# EAGLE design TargetADC (EAGLE 7.3.0)
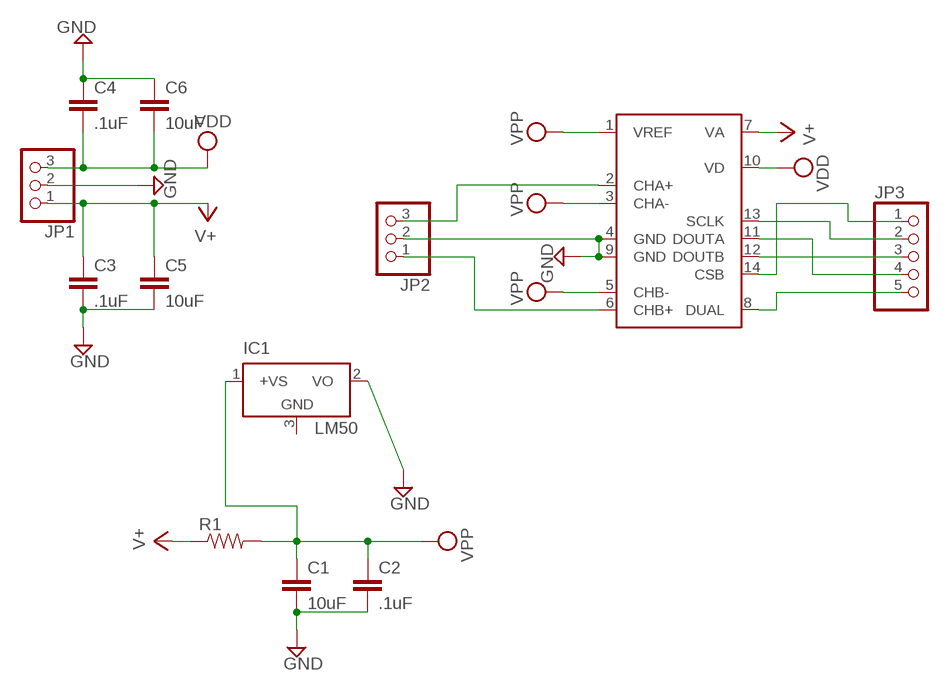
[diagram p0: schematic, sheet 1]

## Parts
C1  10uF  CAP0805  [0805]
C2  .1uF  CAP0805  [0805]
C3  .1uF  CAP0805  [0805]
C4  .1uF  CAP0805  [0805]
C5  10uF  CAP0805  [0805]
C6  10uF  CAP0805  [0805]
IC1  LM50  [SOT23]
JP1  PINHD-1X3  [1X03]
JP2  PINHD-1X3  [1X03]
JP3  PINHD-1X5  [1X05]
R1  RESISTOR0805-RES  [0805]
U1  ADC122S706  [TSSOP14]

## Nets
GND: C1.2 C2.2 C3.2 C4.1 C5.2 C6.1 IC1.2(VO) JP1.2 JP2.2 U1.4(GND) U1.9(GND)
N$1: JP3.4 U1.11(DOUTA)
N$2: JP2.3 U1.2(CHA+)
N$3: JP2.1 U1.6(CHB+)
N$4: JP3.3 U1.12(DOUTB)
N$5: JP3.2 U1.13(SCLK)
N$6: JP3.1 U1.14(CSB)
N$7: JP3.5 U1.8(DUAL)
V+: C3.1 C5.1 JP1.1 R1.1 U1.7(VA)
VDD: C4.2 C6.2 JP1.3 U1.10(VD)
VPP: C1.1 C2.1 IC1.1(+VS) R1.2 U1.1(VREF) U1.3(CHA-) U1.5(CHB-)

## Power pins joined to a net without a drawn wire
GND: IC1.3(GND)

## Library data of the parts
C1-C6 = SparkFun-Capacitors:CAP: Capacitor Standard 0603 ceramic capacitor, and 0.1" leaded capacitor.
IC1 = linear:LM50: SOT-23 Single-Supply Centigrade Temperature Sensor Vout = (10mV/°C x Temp °C) +5mmmV Source: http://cache.national.com/ds/LM/LM50.pdf
JP1 JP2 = pinhead:PINHD-1X3: PIN HEADER
JP3 = pinhead:PINHD-1X5: PIN HEADER
R1 = SparkFun-Resistors:RESISTOR: Resistor Basic schematic elements and footprints for 0603, 1206, and PTH resistors.
U1 = ADC122S706:ADC122S706

## Board
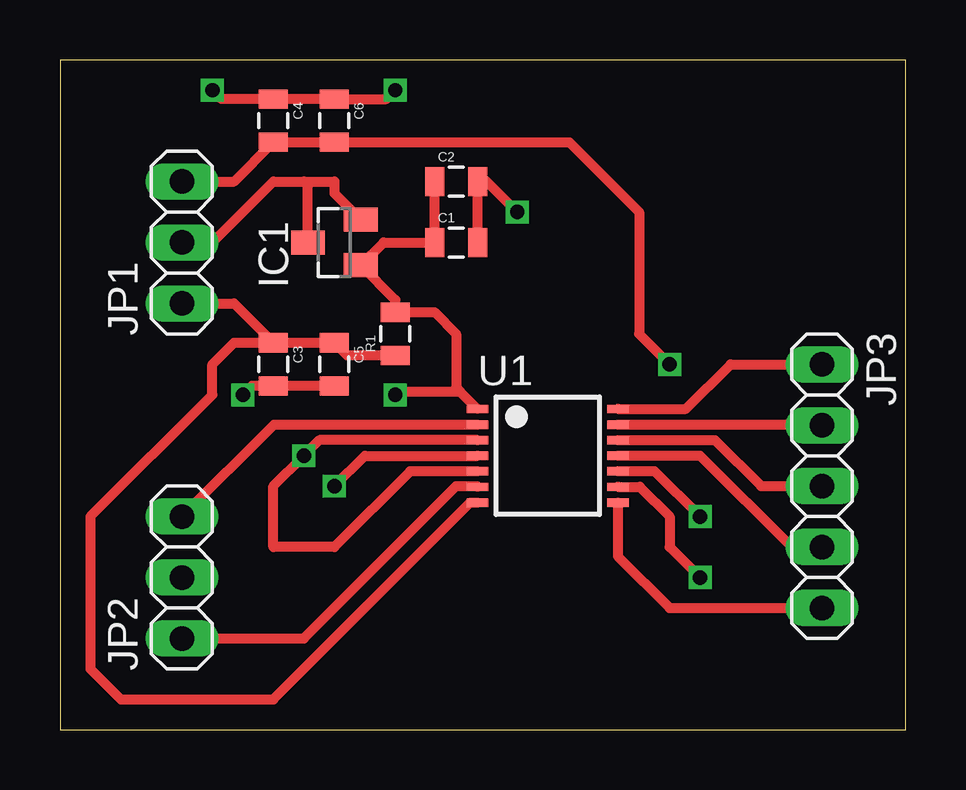
[diagram p1: board, top side]
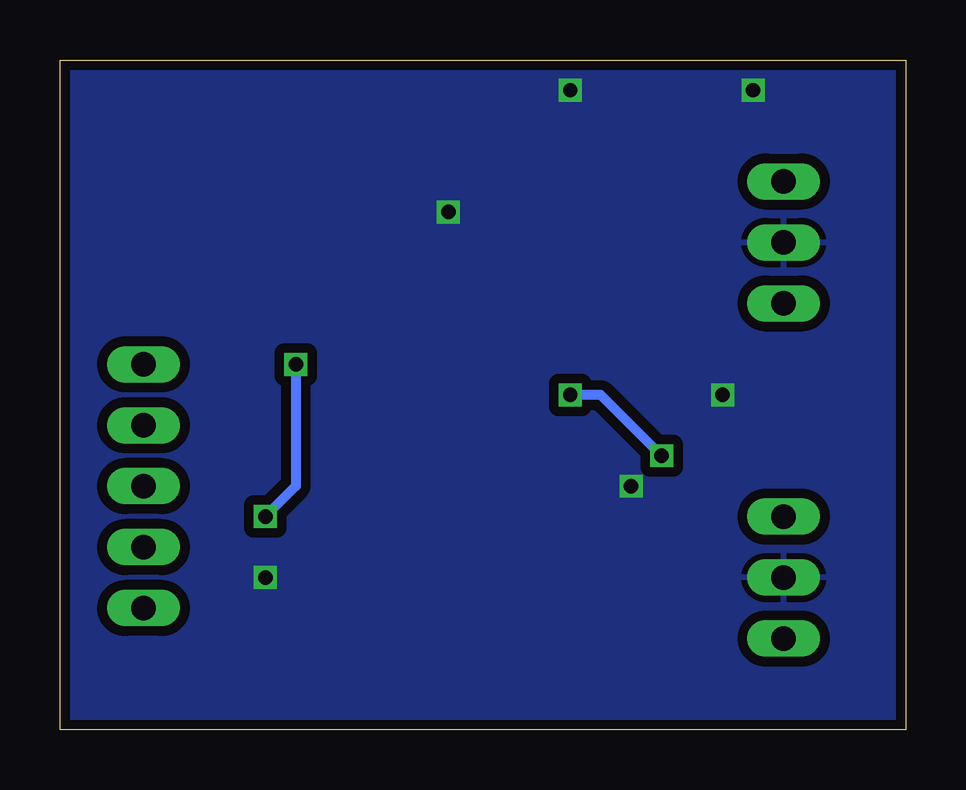
[diagram p2: board, bottom side, seen from below]

Size 35.23 x 27.93 mm. Coordinates in mm from the lower left corner, seen from the top.
Outline: 0,0 35.23,0 35.23,27.93 0,27.93 0,0
Copper layers (1*16): Top 0.0356mm / dielectric 1.5011mm / Bottom 0.0356mm
Design rules "LaenPCBOrder": minimum track width 6mil, minimum drill 13mil, track to track 6mil, track to pad 6mil, pad to pad 6mil, via to via 6mil, smd to smd 6mil, copper to edge 15mil, drill to drill 6mil, minimum pad ring 7mil, minimum via ring 7mil, stop-mask expansion 3mil, vias tented up to drill 0mil, thermal gap 10mil

### Footprints (pad centres in the part's own frame; a part is rotated, then mirrored left to right if it is on the bottom)
0805 = smd 0.8 x 1.2: 1 -0.9,0; 2 0.9,0
SOT23 = smd 1 x 1.4: 1 -0.95,-1.1; 2 0.95,-1.1; 3 0,1.1
1X03 = drill 1.016 long: 1 -2.54,0; 2 0,0; 3 2.54,0
1X05 = drill 1.016 long: 1 -5.08,0; 2 -2.54,0; 3 0,0; 4 2.54,0; 5 5.08,0
TSSOP14 = smd 0.35 x 0.9: 1 -1.95,-2.925; 2 -1.3,-2.925; 3 -0.65,-2.925; 4 0,-2.925; 5 0.65,-2.925; 6 1.3,-2.925; 7 1.95,-2.925; 8 1.95,2.925; 9 1.3,2.925; 10 0.65,2.925; 11 0,2.925; 12 -0.65,2.925; 13 -1.3,2.925; 14 -1.95,2.925

### Placement (x,y rotation side)
C1  16.51,20.32 0 top
C2  16.51,22.86 0 top
C3  8.89,15.24 270 top
C4  8.89,25.4 270 top
C5  11.43,15.24 270 top
C6  11.43,25.4 270 top
IC1  11.43,20.32 90 top
JP1  5.08,20.32 90 top
JP2  5.08,6.35 90 top
JP3  31.75,10.16 270 top
R1  13.97,16.51 90 top
U1  20.32,11.43 270 top

### Tracks (layer width: path | path; a pad name or v marks a point on that pad's centre or on a via)
GND  (via drill 0.6)
  Top 0.406: JP1.2 6.35,20.32 8.89,22.86 10.16,22.86 | 10.16,22.86 11.43,22.86 11.43,22.37 IC1.2 | C1.2 C2.2 17.78,22.86 v19.05,21.59 | U1.9 24.16,10.13 25.4,8.89 25.4,7.62 v26.67,6.35 | v6.35,26.67 6.72,26.3 C4.1 C6.1 13.6,26.3 v13.97,26.67 | C5.2 C3.2 7.99,14.34 v7.62,13.97 | v11.43,10.16 12.7,11.43 U1.4 | IC1.3 10.33,22.69 10.16,22.86
  pour Bottom (isolate 0.406): 0,27.94 35.56,27.94 35.56,0 0,0
N$1
  Top 0.406: JP3.4 30.48,7.62 26.67,11.43 U1.11
N$2
  Top 0.406: JP2.3 8.92,12.73 U1.2
N$3
  Top 0.406: JP2.1 10.16,3.81 16.51,10.16 17.36,10.16 U1.6
N$4
  Top 0.406: U1.12 27.29,12.08 29.21,10.16 JP3.3
N$5
  Top 0.406: U1.13 31.72,12.73 JP3.2
N$6
  Top 0.406: U1.14 26.08,13.38 27.94,15.24 JP3.1
N$7
  Top 0.406: U1.8 23.25,7.23 25.4,5.08 JP3.5
V+
  Top 0.406: JP1.1 7.25,17.78 C3.1 | C3.1 C5.1 11.96,15.61 R1.1 | U1.7 17.1,9.48 8.89,1.27 2.54,1.27 1.27,2.54 1.27,8.89 6.35,13.97 6.35,15.24 7.25,16.14 C3.1
VDD  (via drill 0.6)
  Top 0.406: JP1.3 7.25,22.86 C4.2 C6.2 21.22,24.5 24.13,21.59 24.13,16.51 v25.4,15.24 | v26.67,8.89 24.78,10.78 U1.10
  Bottom 0.406: v25.4,15.24 25.4,10.16 v26.67,8.89
VPP  (via drill 0.6)
  Top 0.406: 16.66,14.12 16.51,14.27 16.51,16.51 15.61,17.41 R1.2 13.97,17.93 IC1.1 13.48,20.32 C1.1 C2.1 | 16.66,14.12 U1.1 | U1.5 14.59,10.78 11.43,7.62 8.89,7.62 8.89,10.16 v10.16,11.43 10.81,12.08 U1.3 | v13.97,13.97 14.12,14.12 16.66,14.12
  Bottom 0.406: v10.16,11.43 12.7,13.97 v13.97,13.97